# Altium schematic sheet czujnik.SchDoc
size A4; SheetNumber: 1; SheetTotal: 1
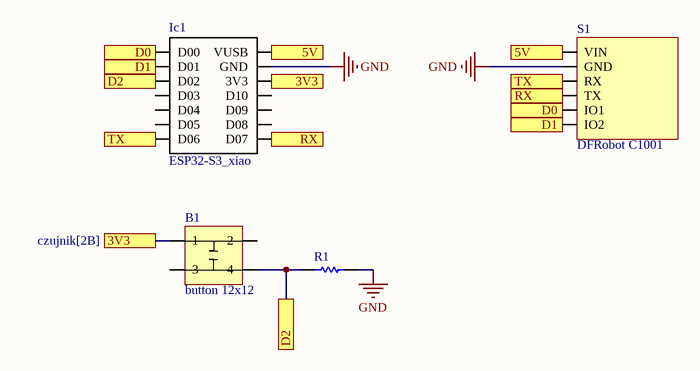
[diagram p0: czujnik.SchDoc]

## Parts
B1  button 12x12  [button12x12]
Ic1  ESP32-S3_xiao  [ESP32-S3]
R1  RC1206FR-10750RL  [RESC3116X65X40LL10T20]  (value not drawn)
S1  DFRobot C1001  [C1001]

## Ports
3V3 (see czujnik[1C]), 3V3 (see czujnik[2B]), 5V (see czujnik[2B]), D0 (see czujnik[1B]), D0 (see czujnik[2B]), D1 (see czujnik[1B]), D1 (see czujnik[2B]), D2 (see czujnik[1B]), D2 (see czujnik[2C]), RX (see czujnik[2B]), TX (see czujnik[1B]), TX (see czujnik[2B])

## Nets
GND: Ic1.13(GND) R1.2 S1.2(GND)
3V3: B1.1 Ic1.12(3V3) ; port 3V3
5V: Ic1.14(VUSB) S1.1(VIN) ; port 5V
D0: Ic1.1(D00) S1.5(IO1) ; port D0
D1: Ic1.2(D01) S1.6(IO2) ; port D1
D2: B1.4 Ic1.3(D02) R1.1 ; port D2
RX: Ic1.8(D07) S1.4(TX) ; port RX
TX: Ic1.7(D06) S1.3(RX) ; port TX

Not connected (* = marked no-connect by the designer): B1 2 3; Ic1 4(D03) 5(D04) 6(D05) 9(D08) 10(D09) 11(D10)

## Library data of the parts
B1 = button12x12
R1 = CMP-2003-04964-1: Manufacturer: Yageo; Part Number: RC1206FR-10750RL
S1 = C1001